# Altium schematic sheet si_chip.SchDoc
size A4; SheetNumber: 4; SheetTotal: 8
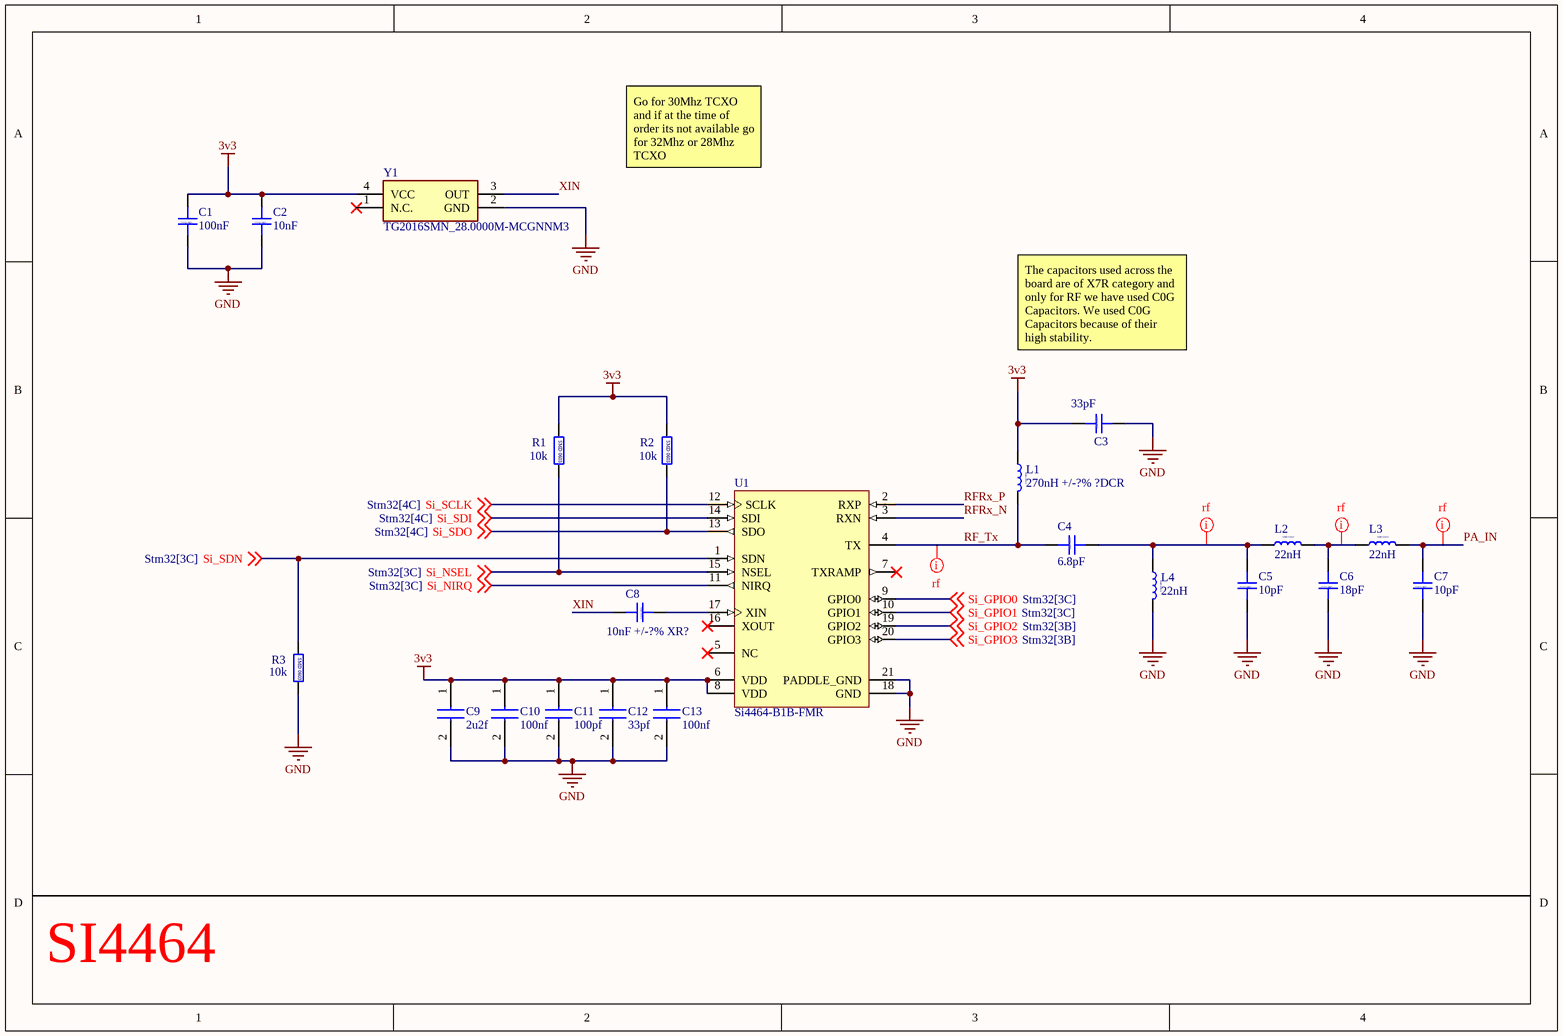
[diagram p0: si_chip.SchDoc]

## Parts
C1  100nF  [CAP_0603]
C2  10nF  [CAP_0603]
C3  33pF  [CAP_0603]
C4  6.8pF  [CAP_0402]
C5  10pF  [CAP_0402]
C6  18pF  [CAP_0402]
C7  10pF  [CAP_0402]
C8  10nF +/-?% XR?  [CAP_0603]
C9  2u2f  [CAPC1608X87N]
C10  100nf  [CAPC1608X87N]
C11  100pf  [CAPC1608X87N]
C12  33pf  [CAPC1608X87N]
C13  100nf  [CAPC1608X87N]
L1  270nH +/-?% ?DCR  [IND_0603]
L2  22nH  [IND_0402]
L3  22nH  [IND_0402]
L4  22nH  [IND_0402]
R1  10k  [RES_0603]
R2  10k  [RES_0603]
R3  10k  [RES_0603]
U1  Si4464-B1B-FMR  [SLAB-QFN-20-2600x2600TP_M]
Y1  TG2016SMN_28.0000M-MCGNNM3  [TG2016SMN250000MMCGNNM3]

## Nets
3v3: C1.2 C2.2 C3.1 C9.1 C10.1 C11.1 C12.1 C13.1 L1.1 R1.1 R2.1 U1.6(VDD) U1.8(VDD) Y1.4(VCC)
GND: C1.1 C2.1 C3.2 C5.1 C6.1 C7.1 C9.2 C10.2 C11.2 C12.2 C13.2 L4.2 R3.2 U1.18(GND) U1.21(PADDLE_GND) Y1.2(GND)
PA_IN: C7.2 L3.2
RF_Tx: C4.1 L1.2 U1.4(TX)
RFRx_N: U1.3(RXN)
RFRx_P: U1.2(RXP)
Si_GPIO0: U1.9(GPIO0) ; off-sheet Si_GPIO0
Si_GPIO1: U1.10(GPIO1) ; off-sheet Si_GPIO1
Si_GPIO2: U1.19(GPIO2) ; off-sheet Si_GPIO2
Si_GPIO3: U1.20(GPIO3) ; off-sheet Si_GPIO3
Si_NIRQ: U1.11(NIRQ) ; off-sheet Si_NIRQ
Si_NSEL: R1.2 U1.15(NSEL) ; off-sheet Si_NSEL
Si_SCLK: U1.12(SCLK) ; off-sheet Si_SCLK
Si_SDI: U1.14(SDI) ; off-sheet Si_SDI
Si_SDN: R3.1 U1.1(SDN) ; off-sheet Si_SDN
Si_SDO: R2.2 U1.13(SDO) ; off-sheet Si_SDO
XIN: C8.2 Y1.3(OUT)
NetC4_2: C4.2 C5.2 L2.1 L4.1
NetC6_2: C6.2 L2.2 L3.1
NetC8_1: C8.1 U1.17(XIN)

Not connected (* = marked no-connect by the designer): U1 5(NC)* 7(TXRAMP)* 16(XOUT)*; Y1 1(N.C.)*

## Layout directives
net class rf: NetC4_2, NetC6_2, PA_IN, RF_Tx

## Notes on the sheet
- Go for 30Mhz TCXO and if at the time of order its not available go for 32Mhz or 28Mhz TCXO
- The capacitors used across the board are of X7R category and only for RF we have used C0G Capacitors. We used C0G Capacitors because of their high stability.
- SI4464
- (in symbol Capacitor-SMD-0402) SMD 0402
- (in symbol Capacitor-SMD-0603) SMD 0603
- (in symbol Inductor-SMD-RF-0402) SMD 0402
- (in symbol Inductor-SMD-RF-0603) SMD 0603
- (in symbol Resistor-SMD-0603) SMD 0603

## Library data of the parts
C1-C3 C8 = Capacitor-SMD-0603: Capacitor SMD 0603 RATED
C4-C7 = Capacitor-SMD-0402: Capacitor SMD 0402 RATED
C9-C13 = 0603N470J500CT: Capacitor; Manufacturer_Name: Walsin Technology Corporation; Datasheet Link: https://datasheet.datasheetarchive.com/originals/distributors/DKDS41/DSANUWW0027552.pdf; Height: 0.87mm; Manufacturer_Part_Number: 0603N470J500CT; Mouser Part Number: 791-0603N470J500CT; Mouser Price/Stock: https://www.mouser.co.uk/ProductDetail/Walsin/0603N470J500CT?qs=ZrPdAQfJ6DOWJe9N0xQVbw%3D%3D
L1 = Inductor-SMD-RF-0603: Inductor SMD 0603
L2-L4 = Inductor-SMD-RF-0402: Inductor SMD 0402
R1-R3 = Resistor-SMD-0603: Resistor SMD 0603 RATED
U1 = CMP-0520-00036-1: High-Performance, Low-Current Transceiver, 119 to 960 MHz, -20 to 20 dBm Output Power, -40 to 85 degC, 20-pin QFN, Tape and Reel; Manufacturer: Silicon Labs; Sub-Family: EZRadioPRO; FSK/GFSK: 500 kbps; OOK: 120 kbps; RX Current: 10.6/13.6 mA; ComponentLink3URL: http://www.silabs.com/Support%20Documents/TechnicalDocs/Si4464-63-61-60.pdf; Code_JEDEC: MO-220; PartNumber: Si4464-B1B-FMR; ComponentLink2URL: http://www.silabs.com/Support Documents/TechnicalDocs/Si4464-63-61-60.pdf; Output Power Range: -20 to 20 dBm; Frequency Range: 119 to 960 MHz; DatasheetVersion: Rev. 1.2; Code_IPC: J-STD-020C; Mounting Technology: Surface Mount; PackageDescription: 20-Pin Quad-Flat No-Leads Package, Body 4 x 4 mm, Pitch 0.5 mm; Packing: Tape and Reel; ComponentLink1URL: http://www.silabs.com/; ComponentLink2Description: Datasheet; PackageReference: QFN-20; ComponentLink1Description: Manufacturer URL; ComponentLink3Description: Package Specification
Y1 = TG2016SMN_25.0000M-MCGNNM3: Crystal or Oscillator; Manufacturer_Name: Epson Timing; Manufacturer_Part_Number: TG2016SMN 25.0000M-MCGNNM3; Datasheet Link: https://support.epson.biz/td/api/doc_check.php?dl=app_TG2016SMN&lang=en; Height: 0.73mm; Mouser Part Number: 732-TG216S25MCGNNM3; Mouser Price/Stock: https://www.mouser.co.uk/ProductDetail/Epson-Timing/TG2016SMN-25.0000M-MCGNNM3?qs=d0WKAl%252BL4Ka73EeK48LHvA%3D%3D; Arrow Part Number: TG2016SMN 25.0000M-MCGNNM3; Arrow Price/Stock: https://www.arrow.com/en/products/tg2016smn-25.0000m-mcgnnm3/epson-electronics-america?region=nac